# Altium project Launch_Controller.PrjPcb
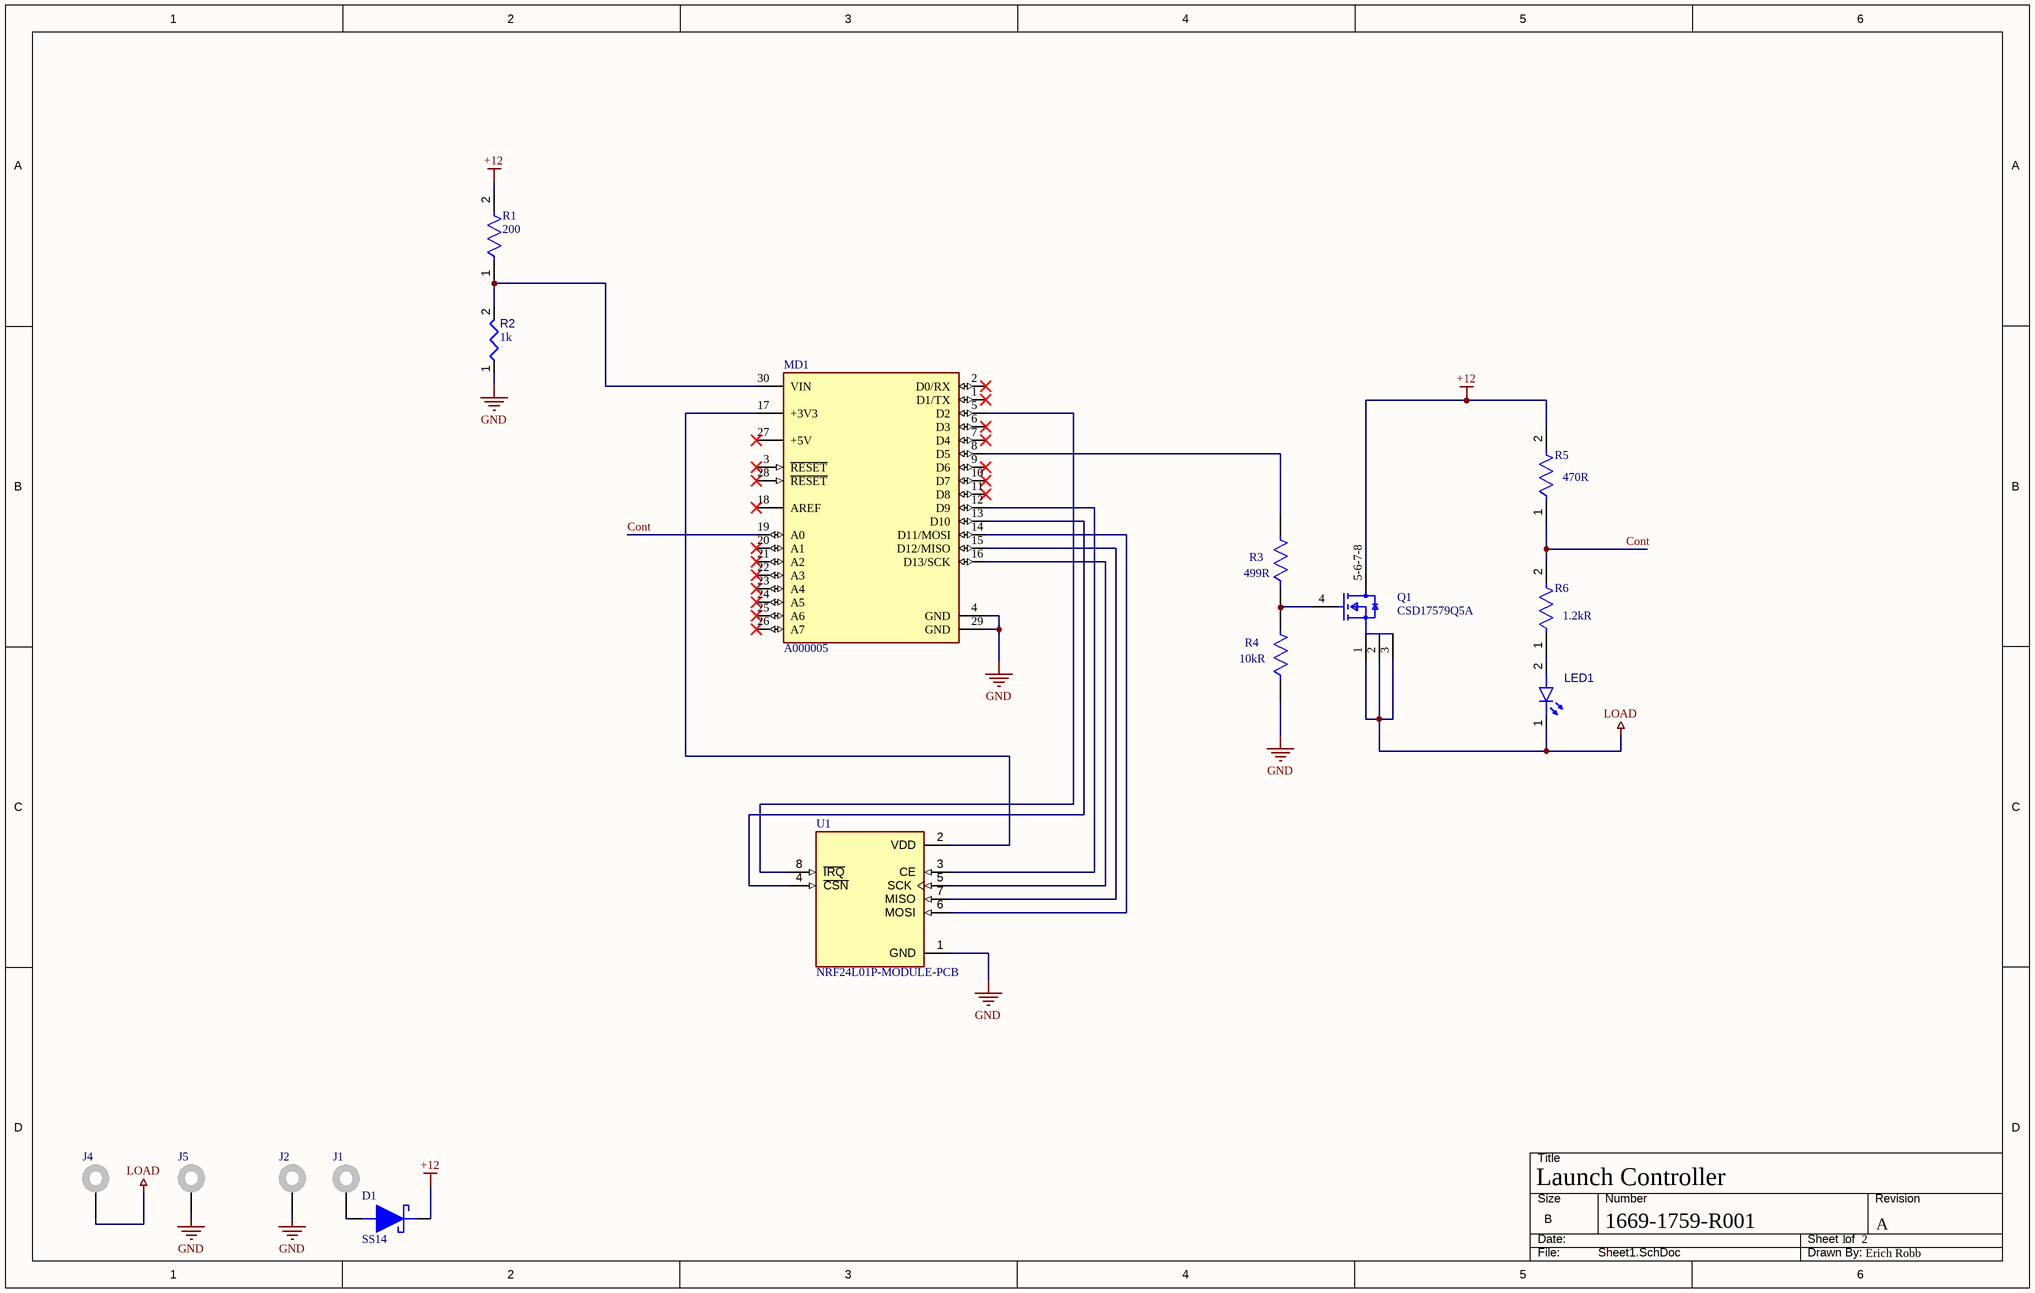
[diagram p0: Sheet1.SchDoc]
Author: Erich Robb; Title: Launch Controller
2 sheets, 27 parts. Net scope: global (net labels, ports and power ports of the same name join across sheets).
Board file: PCB2.PcbDoc
Sheets:
  Sheet1.SchDoc
  Sheet2.SchDoc

## Sheet Sheet1.SchDoc: Launch Controller
size B; DrawnBy: Erich Robb; DocumentNumber: 1669-1759-R001; Revision: A; SheetNumber: 1; SheetTotal: 2

### Parts
D1  SS14  [DIOM5227X270N]
J1  575-8  [KSTN-575-8]  (value not drawn)
J2  575-8  [KSTN-575-8]  (value not drawn)
J4  575-8  [KSTN-575-8]  (value not drawn)
J5  575-8  [KSTN-575-8]  (value not drawn)
LED1  QBLP595-IB  [QTB-QBLP595_V]  (value not drawn)
MD1  A000005  [FP-A000005-MFG]
Q1  CSD17579Q5A  [FP-DQJ0008A-MFG]
R1  value 200  [FP-RC3216-IPC_A]  (hidden comment: RC3216F201CS)
R2  value 1k  [FP-MCA1206-IPC_A]  (hidden comment: MCA12060C1001FP500)
R3  value 499R  [FP-RT1206-MFG]  (hidden comment: RT1206FRE07499RL)
R4  Resistance: 10kR  [FP-CRCW1206-e3-IPC_C]  (hidden comment: CRCW120610K0FKEA)
R5  Resistance: 470R  [FP-CRCW1206-e3-IPC_A]  (hidden comment: CRCW1206470RJNEA)
R6  Resistance: 1.2kR  [FP-RC3216-IPC_A]  (hidden comment: RC3216J122CS)
U1  NRF24L01P-MODULE-PCB  [XCVR_NRF24L01P-MODULE-PCB]

### Nets
+12: D1.1(K) Q1.5-6-7-8(D) R1.2 R5.2
GND: J2.1 J5.1 MD1.4(GND) MD1.29(GND) R2.1 R4.1 U1.1(GND)
LOAD: J4.1 LED1.1(K) Q1.1(S) Q1.2(S) Q1.3(S)
Cont: MD1.19(A0) R5.1 R6.2
NetD1_2: D1.2(A) J1.1
NetLED1_2: LED1.2(A) R6.1
NetMD1_5: MD1.5(D2) U1.8(~{IRQ})
NetMD1_8: MD1.8(D5) R3.2
NetMD1_12: MD1.12(D9) U1.3(CE)
NetMD1_13: MD1.13(D10) U1.4(~{CSN})
NetMD1_14: MD1.14(D11/MOSI) U1.6(MOSI)
NetMD1_15: MD1.15(D12/MISO) U1.7(MISO)
NetMD1_16: MD1.16(D13/SCK) U1.5(SCK)
NetMD1_17: MD1.17(+3V3) U1.2(VDD)
NetMD1_30: MD1.30(VIN) R1.1 R2.2
NetQ1_4: Q1.4(G) R3.1 R4.2

Not connected (* = marked no-connect by the designer): MD1 1(D1/TX)* 2(D0/RX)* 3(~{RESET})* 6(D3)* 7(D4)* 9(D6)* 10(D7)* 11(D8)* 18(AREF)* 20(A1)* 21(A2)* 22(A3)* 23(A4)* 24(A5)* 25(A6)* 26(A7)* 27(+5V)* 28(~{RESET})*

### Library data of the parts
D1 = CMP-004-00031-2: Diode Schottky 40 V 1A Surface Mount DO-214AC (SMA); MF: ON Semiconductor; SnapEDA_Link: https://www.snapeda.com/parts/SS14/Onsemi/view-part/?ref=snap; Pins: 2; Case/Package: SMA-2 ON Semiconductor; Check_prices: https://www.snapeda.com/parts/SS14/Onsemi/view-part/?ref=eda; MP: SS14; Design Item ID: SS14; Source: SS14.SchLib; Component Type: Standard; Value: *
J1 J2 J4 J5 = CMP-1672-00007-5: Non-Insulated Jack, Through Hole, RoHS, Bulk; Manufacturer: Keystone; PackageDescription: 1-Pin Through Hole Device, Dia 7.92 mm; PackageReference: 575-8; ComponentLink1Description: Manufacturer URL; Mounting Technology: Through Hole; ComponentLink2URL: http://www.keyelco.com/product-pdf.cfm?p=2379; ComponentLink2Description: Datasheet; DatasheetVersion: Rev. B, 11/1994; ComponentLink1URL: http://www.keyelco.com/
LED1 = CMP-007-00042-3: Chip LED 0402, Blue, 0.02 A, 3.1 to 3.7 V, -40 to 80 degC, 2-Pin SMD, RoHS, Tape and Reel; RoHS Compliant: Yes; Colour: Blue; Pins: 2; Case/Package: 0402; Mounting Technology: SMT
MD1 = CMP-189986-000002-1: ARDUINO NANO ATMEGA328 EVAL BRD; Number of Bits: 8; Evaluation Kit: Yes; Operating Supply Voltage: 12V; Interface: I2C; Data Bus Width: 8b; Core Architecture: AVR; Packaging: Bulk; Length: 7inch; Package Quantity: 50; Width: 5inch; REACH SVHC: No SVHC; Weight: 0.358383oz; Series: AVR® ATmega; Height: 0.25inch
Q1 = CMP-013-00034-3: 30V, N ch NexFET MOSFET, single SON5x6, 13.3mOhm 8-VSONP; MF: Texas Instruments; Terminal Finish: Tin; Purchase-URL: https://pricing.snapeda.com/search/part/CSD17579Q5A/?ref=eda; JESD-609 Code: e3; Check_prices: https://www.snapeda.com/parts/CSD17579Q5A/Texas+Instruments/view-part/?ref=eda; Pins: 8; Design Item ID: CSD17579Q5A; Price: None; Value: *; Component Type: Standard; MP: CSD17579Q5A; Moisture Sensitivity Level: 1; Case/Package: VSONP-8 Texas Instruments; Source: CSD17579Q5A.SchLib; Peak Reflow Temperature (Cel): 260°C; SnapEDA_Link: https://www.snapeda.com/parts/CSD17579Q5A/Texas+Instruments/view-part/?ref=snap; Reach SVHC Compliant: No; Availability: In Stock; RoHS Compliant: Yes
R1 = CMP-009-00180-1: Fixed Resistor, Metal Glaze/thick Film, 0.25W, 200ohm, 200V, 1% +/-Tol, 100ppm/Cel, Surface Mount, 1206; Power: 250mW; Max Operating Temperature: 155°C; Case/Package: 1206; Mounting Technology: Surface Mount; Min Operating Temperature: -55°C; RoHS Compliant: Yes; Pins: 2; Tolerance: 1%
R2 = CMP-009-00181-2: Fixed Resistor, Thin Film, 0.25W, 1000ohm, 200V, 1% +/-Tol, 50ppm/Cel, Surface Mount, 1206; Power: 250mW; RoHS Compliant: Yes; Min Operating Temperature: -55°C; Max Operating Temperature: 125°C; Mounting Technology: Surface Mount; Case/Package: 1206; Pins: 2; Tolerance: 1%
R3 = CMP-2003-04117-2: RES SMD 499 OHM 1% 1/4W 1206; Manufacturer: Yageo; Voltage Rating: 200V; Tolerance: 0.0002; Resistance: 499Ω; Temperature Coefficient: 50 ppm/°C; Power Rating: 0.25W; Manufacturer Part Number: RT1206FRE07499RL; Temperature Range Low: -55°C; ComponentLink2URL: http://www.yageo.com/documents/recent/PYu-RT_1-to-0.01_RoHS_L_9.pdf; Footprint Url: http://www.yageo.com/exep/pages/download/literatures/PYu-R_Mount_10.pdf; Series: RT; ComponentLink2Description: Datasheet; Temperature: -55°C to +155°C; Package: RT1206; Temperature Range High: +155°C; Digikey Description: RES SMD 499 OHM 1% 1/4W 1206; Category: Res; Lead Free: Yes; Mouser Description: Res SMD 499 Ohm 1% 1/8W 1206; Ipc Land Pattern Name: RESC310160X55; Composition: Thin Film; Device Class L3: Chip SMD Resistors; Automotive: No; RoHS: TRUE; Device Class L1: Passive Components; Height: 0.65mm; Octopart: https://octopart.com/rt1206fre07499rl-yageo-1402563; Device Class L2: Resistors
R4 = CMP-2003-04807-2: RES Thick Film, 10kΩ, 1%, 0.25W, 100ppm/°C, 1206; Working Voltage: 200V; Max Power Dissipation: 250mW; Tolerance: 1%; Width: 0.063inch; Height: 0.55mm; Number of Pins: 2; Voltage Rating: 200V; Temperature Coefficient: 100ppm/°C; Military Standard: Not; Features: Automotive AEC-Q200; Depth: 1.6mm; Radiation Hardening: No; Termination: SMD/SMT; Case Code (Imperial): 1206; Weight: 0.000353oz; Length: 3.2mm; Package Quantity: 10; Voltage Rating (DC): 200V; Case/Package: 1206; Min Operating Temperature: -55°C; Number of Terminations: 2; Composition: Thick Film; Contact Plating: Tin; Power Rating: 250mW; Packaging: Tape and Reel; Max Operating Temperature: 155°C; Lead Free: Lead Free; Case Code (Metric): 3216
R5 = CMP-2003-02207-2: RES Thick Film, 470Ω, 5%, 0.25W, 200ppm/°C, 1206; Voltage Rating: 200V; Power Rating: 250mW; Lead Free: Lead Free; Width: 1.6mm; Contact Plating: Tin; Termination: SMD/SMT; Military Standard: Not; Temperature Coefficient: 200ppm/°C; Height: 0.55mm; Case Code (Imperial): 1206; Composition: Thick Film; Min Operating Temperature: -55°C; Weight: 0.000353oz; Radiation Hardening: No; Length: 3.2mm; Tolerance: 5%; Packaging: Tape and Reel; Voltage Rating (DC): 200V; Max Operating Temperature: 155°C; Package Quantity: 5000; Case/Package: 1206; Case Code (Metric): 3216; Depth: 1.6mm
R6 = CMP-13261-002668-1: Res Thick Film 1206 1.2kΩ 5% 0.25W ±100ppm/°C Molded SMD T/R; Max Power Dissipation: 250mW; Length: 3.2mm; Tolerance: 5%; Features: Moisture Resistant; Depth: 1.6mm; Temperature Coefficient: 100ppm/°C; Width: 0.063inch; Radiation Hardening: No; Military Standard: Not; Contact Plating: Tin; Composition: Thick Film; Min Operating Temperature: -55°C; Number of Terminations: 2; Packaging: Tape and Reel; Case Code (Imperial): 1206; Height: 0.026inch; Max Operating Temperature: 155°C; Case/Package: 1206; Case Code (Metric): 3216
U1 = CMP-005-000000-1: - Transceiver For Use With nRF24L01+; MF: Nordic Semiconductor; Component Type: Standard; Pin Count: 8; Source: NRF24L01P-MODULE-PCB.SchLib; Value: *; Design Item ID: NRF24L01P-MODULE-PCB; Mouser-Purchase-URL: https://snapeda.com/shop?store=Mouser&id=230534; Availability: Bad; Package: None; Price: None; SnapEDA_Link: https://www.snapeda.com/parts/NRF24L01P-MODULE-PCB/Nordic%20Semiconductor%20ASA/view-part/230534/?ref=snap; MP: NRF24L01P-MODULE-PCB

## Sheet Sheet2.SchDoc: Launch Controller
size B; DocumentNumber: 1669-1759-T001; Revision: A; SheetNumber: 2; SheetTotal: 2
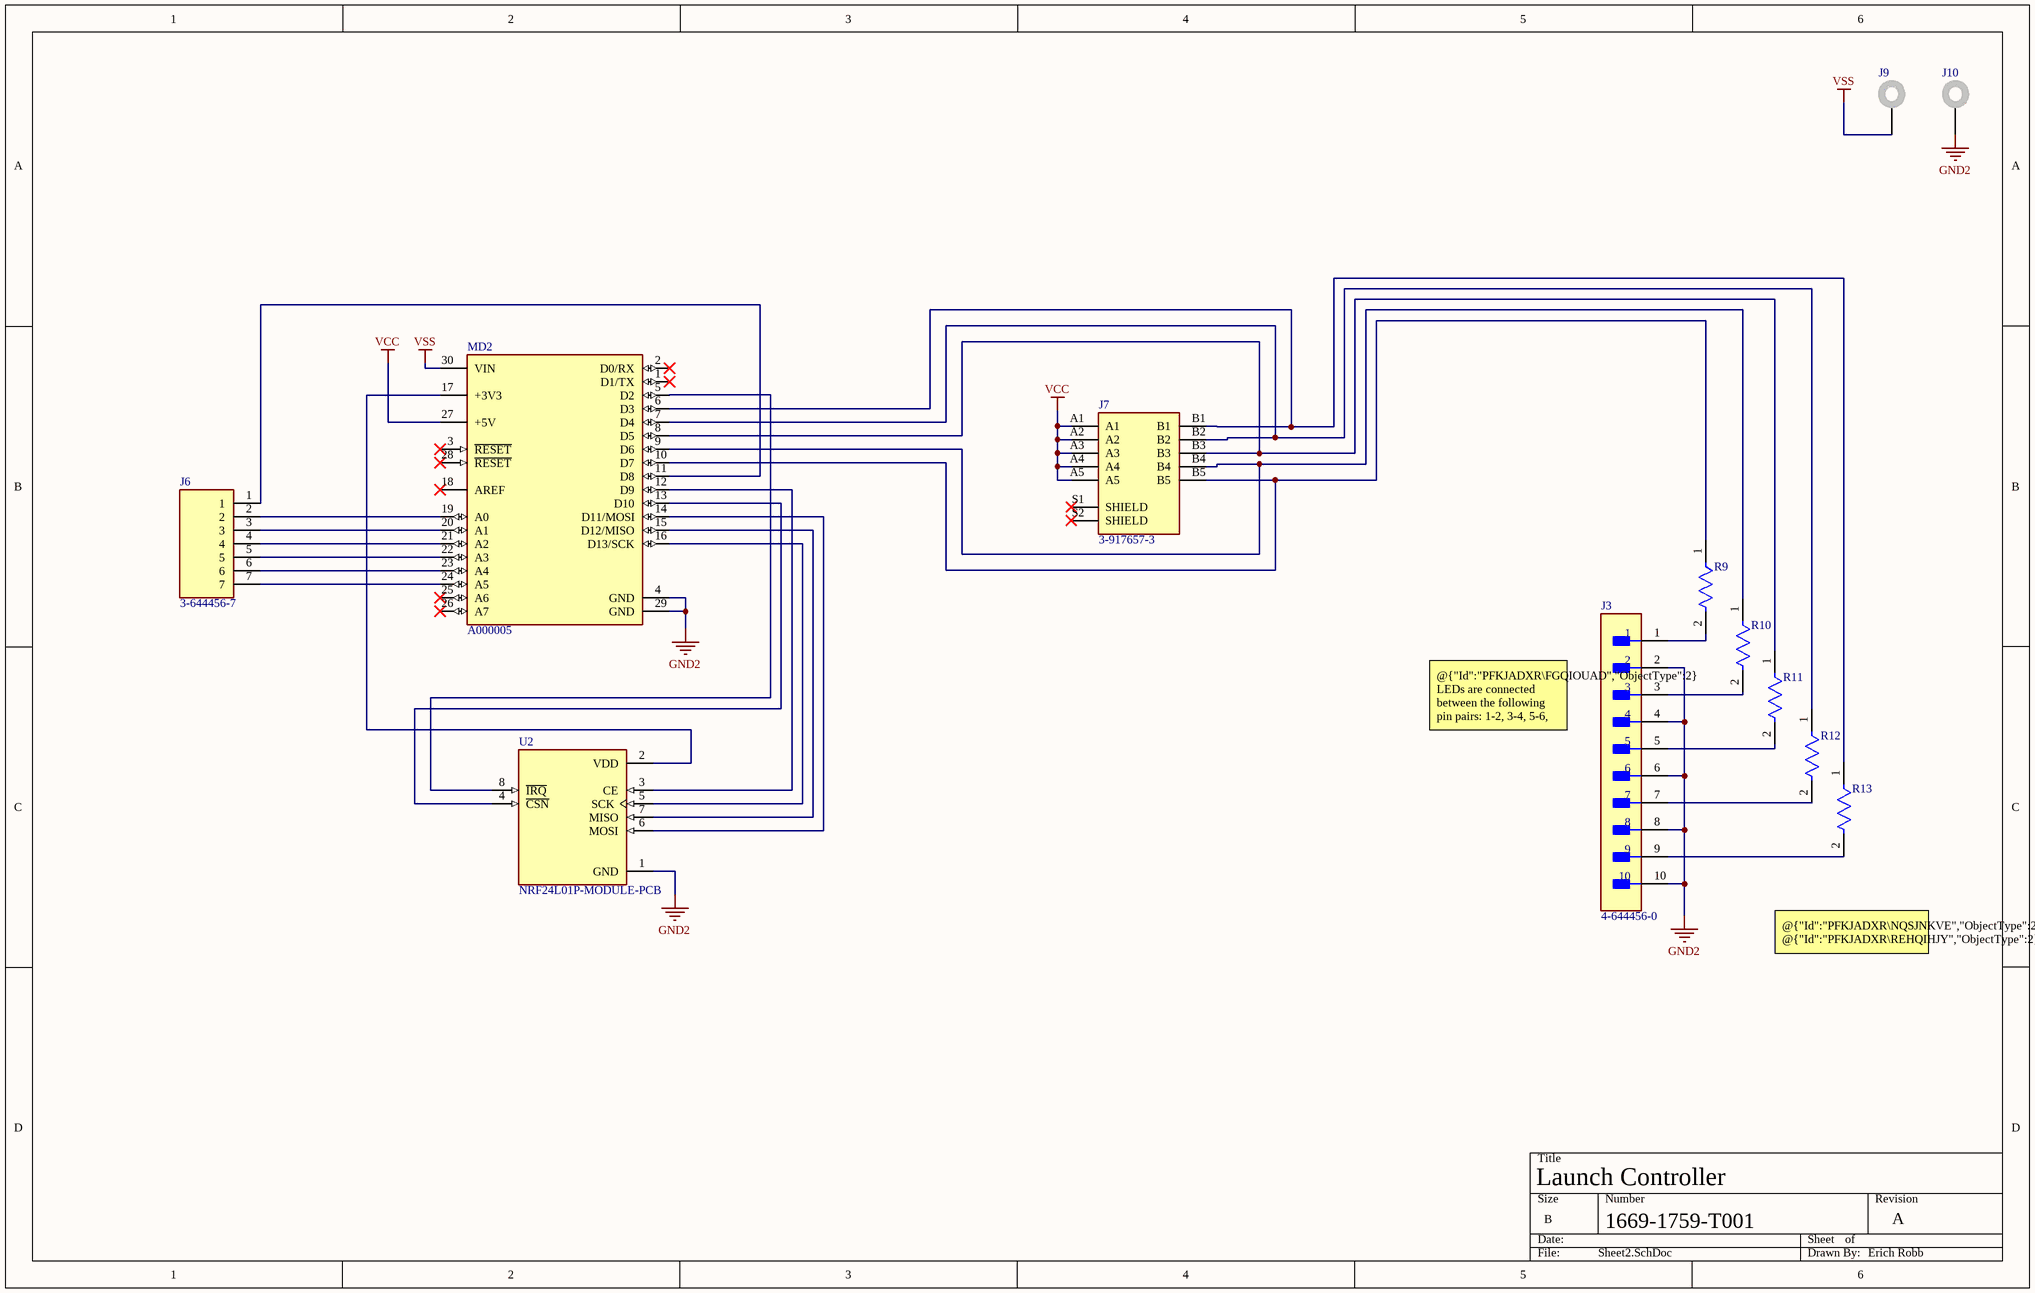
[diagram p1: Sheet2.SchDoc]

### Parts
J3  4-644456-0  [FP-4-644456-0-MFG]
J6  3-644456-7  [TE_3-644456-7]
J7  3-917657-3  [TE_3-917657-3]
J9  575-8  [KSTN-575-8]  (value not drawn)
J10  575-8  [KSTN-575-8]  (value not drawn)
MD2  A000005  [FP-A000005-MFG]
R9  CRGCQ1206J330R  [FP-CRGCQ1206-IPC_C]  (value not drawn)
R10  CRGCQ1206J330R  [FP-CRGCQ1206-IPC_C]  (value not drawn)
R11  CRGCQ1206J330R  [FP-CRGCQ1206-IPC_C]  (value not drawn)
R12  CRGCQ1206J330R  [FP-CRGCQ1206-IPC_C]  (value not drawn)
R13  CRGCQ1206J330R  [FP-CRGCQ1206-IPC_C]  (value not drawn)
U2  NRF24L01P-MODULE-PCB  [XCVR_NRF24L01P-MODULE-PCB]

### Nets
GND2: J3.2 J3.4 J3.6 J3.8 J3.10 J10.1 MD2.4(GND) MD2.29(GND) U2.1(GND)
VCC: J7.A1 J7.A2 J7.A3 J7.A4 J7.A5 MD2.27(+5V)
VSS: J9.1 MD2.30(VIN)
NetJ3_1: J3.1 R9.2
NetJ3_3: J3.3 R10.2
NetJ3_5: J3.5 R11.2
NetJ3_7: J3.7 R12.2
NetJ3_9: J3.9 R13.2
NetJ6_1: J6.1 MD2.11(D8)
NetJ6_2: J6.2 MD2.19(A0)
NetJ6_3: J6.3 MD2.20(A1)
NetJ6_4: J6.4 MD2.21(A2)
NetJ6_5: J6.5 MD2.22(A3)
NetJ6_6: J6.6 MD2.23(A4)
NetJ6_7: J6.7 MD2.24(A5)
NetJ7_B1: J7.B1 MD2.6(D3) R13.1
NetJ7_B2: J7.B2 MD2.7(D4) R12.1
NetJ7_B3: J7.B3 MD2.8(D5) R11.1
NetJ7_B4: J7.B4 MD2.9(D6) R10.1
NetJ7_B5: J7.B5 MD2.10(D7) R9.1
NetMD2_5: MD2.5(D2) U2.8(~{IRQ})
NetMD2_12: MD2.12(D9) U2.3(CE)
NetMD2_13: MD2.13(D10) U2.4(~{CSN})
NetMD2_14: MD2.14(D11/MOSI) U2.6(MOSI)
NetMD2_15: MD2.15(D12/MISO) U2.7(MISO)
NetMD2_16: MD2.16(D13/SCK) U2.5(SCK)
NetMD2_17: MD2.17(+3V3) U2.2(VDD)

Not connected (* = marked no-connect by the designer): J7 S1(SHIELD)* S2(SHIELD)*; MD2 1(D1/TX)* 2(D0/RX)* 3(~{RESET})* 18(AREF)* 25(A6)* 26(A7)* 28(~{RESET})*

### Notes on the sheet
- @{"Id":"PFKJADXR\FGQIOUAD","ObjectType":2} LEDs are connected between the following pin pairs: 1-2, 3-4, 5-6, 7-8, 9-10.
- @{"Id":"PFKJADXR\NQSJNKVE","ObjectType":2} @{"Id":"PFKJADXR\REHQIHJY","ObjectType":2} @{"Id":"PFKJADXR\ZYVDQRQZ","ObjectType":2} @{"Id":"PFKJADXR\NCDOSIKG","ObjectType":2} @{"Id":"PFKJADXR\DLTFFKSW","ObjectType":2} Resistors all 330 Ohm

### Library data of the parts
J3 = CMP-015-000000-2: Conn Unshrouded Header HDR 10 POS 2.54mm Solder ST Top Entry Thru-Hole Bag/Box; Plating: Tin; Contact Retention: No (Without); Operating Supply Voltage: 250V; Current Rating: 5A; PCB Thickness: 0.063inch; Approvals: CSA; Tail Length: 0.11inch; PCB Mount Retention: Without; Number of Positions: 10; Connector Type: Plug,Header,Pin; Plating Thickness: 1.27um; Circuit Application: Signal; Contact Style: Straight; Connector System: Wire-to-Board; PCB Mounting Orientation: Vertical; Underplate Material: Nickel; Gender: Male; Contact Resistance: 6mR; Component Type: Standard; Contact Plating: Tin,Matte; Availability: Unavailable; Radiation Hardening: No; Voltage Rating (AC): 250V; Orientation: Straight; Backwall/Post Interruptions: No (Without); Source: 4-644456-0.SchLib; Flammability Rating: UL94 V-0; Contact Shape: Square; MP: 4-644456-0; Shrouded: No (Without); Number of Rows: 1; Contact Material: Copper Alloy; Series: MTA-100; Strain Relief: No (Without); Termination: Solder; Mounting Technology: Through Hole; Contact Gender: Male; Max Operating Temperature: 221°C; Voltage Rating: 250V; RoHS Compliant: Yes; Package: None; Depth: 2.33mm; Color: Natural; Design Item ID: 4-644456-0; Packaging: Bag; Mating Retention: No (Without); Contact Current Rating: 5A; Pin Count: 10; Pitch: 2.54mm; Housing Color: Natural; Height: 10.03mm; Package Quantity: 500; Length: 25.1mm; Mating Alignment: No (Without); Lead Free: Lead Free; ELV: Compliant; Min Operating Temperature: -67°C; Price: None; Contact Mating Length: 7.49mm; Contact Type: Male Pin; PCB Mount Alignment: No (Without); Number of Contacts: 10; Value: *; Housing Material: Polyester; Max Voltage Rating (AC): 250V; Sealable: No (Without)
J6 = CMP-002-00071-2: Header; 0.1 in. (Centerline); White (Housing); Polyester; 7; UL 94V-0; Gender: Male; Connector Type: Plug,Header,Pin; MF: TE Connectivity; Voltage Rating: 250V; Mouser-Purchase-URL: https://snapeda.com/shop?store=Mouser&id=554533; Mounting Technology: Through Hole; Value: *; Source: 3-644456-7.SchLib; Max Operating Temperature: 221°C; Digi-Key_Part_Number: A31117-ND; DigiKey-Purchase-URL: https://snapeda.com/shop?store=DigiKey&id=554533; Pins: 7; Min Operating Temperature: -67°C; Component Type: Standard; SnapEDA_Link: https://www.snapeda.com/parts/3-644456-7/TE%20Connectivity%20AMP%20Connectors/view-part/554533/?ref=snap; Case/Package: None; Design Item ID: 3-644456-7; RoHS Compliant: Yes; EU_RoHS_Compliance: Compliant; MP: 3-644456-7
J7 = CMP-007-000000-1: Source: 3-917657-3.SchLib; Package: None; Price: None; Design Item ID: 3-917657-3; Value: *; MP: 3-917657-3; Pin Count: 12; Availability: Unavailable; Component Type: Standard
J9 J10 = CMP-1672-00007-5: as J1 on sheet Sheet1; PackageDescription: 1-Pin Through Hole Device, Dia 7.92 mm; PackageReference: 575-8; ComponentLink1Description: Manufacturer URL; Mounting Technology: Through Hole; ComponentLink2URL: http://www.keyelco.com/product-pdf.cfm?p=2379; ComponentLink2Description: Datasheet; DatasheetVersion: Rev. B, 11/1994; ComponentLink1URL: http://www.keyelco.com/
MD2 = CMP-189986-000002-1: as MD1 on sheet Sheet1; Packaging: Bulk; Length: 7inch; Package Quantity: 50; Width: 5inch; REACH SVHC: No SVHC; Weight: 0.358383oz; Series: AVR® ATmega; Height: 0.25inch
R9-R13 = CMP-03211-006050-1: CRGCQ1206 330Ω 0.25W 5% ±100ppm/°C 200V; Manufacturer: TE Connectivity; Tolerance: 0.05; Automotive Grade: Grade 572; Ambient Temperature Range High: +70°C; ComponentLink2Description: Datasheet; Series: CRGCQ; Device Class L1: Passive Components; Voltage Rating: 200V; Temperature Coefficient: ±100ppm/°C; Composition: Thick Film; Category: Res; ComponentLink2URL: https://www.te.com/commerce/DocumentDelivery/DDEController?Action=showdoc&DocId=Data+Sheet%7F1773204-3%7F1%7Fpdf%7FEnglish%7FENG_DS_1773204-3_1.pdf%7F4-2176347-581; Power Rating: 0.25W; Temperature: -55°C to +155°C; Ipc Land Pattern Name: RESC310155X55; Height: 0.65mm; Value: 330Ω; Resistance: 330Ω; Lead Free: Yes; Manufacturer Part Number: CRGCQ1206J330R; Device Class L3: Chip SMD Resistors; Device Class L2: Resistors; Package: CRGCQ1206; Temperature Range High: +155°C; Temperature Range Low: -55°C; Automotive: Yes; RoHS: TRUE; Octopart: https://octopart.com/crgcq1206j330r-te+connectivity-91018326
U2 = CMP-005-000000-1: as U1 on sheet Sheet1; Component Type: Standard; Pin Count: 8; Source: NRF24L01P-MODULE-PCB.SchLib; Value: *; Design Item ID: NRF24L01P-MODULE-PCB; Mouser-Purchase-URL: https://snapeda.com/shop?store=Mouser&id=230534; Availability: Bad; Package: None; Price: None; SnapEDA_Link: https://www.snapeda.com/parts/NRF24L01P-MODULE-PCB/Nordic%20Semiconductor%20ASA/view-part/230534/?ref=snap; MP: NRF24L01P-MODULE-PCB